# EasyEDA Pro project ProPrj_supercap v0.1_2026-02-15.epro, schematic Schematic1, sheets 1 to 3 of 5

## Sheets
1 P1: Board Name: Board1; Create Date: 2026-01-01; Page Name: P1; Project Name: supercap v0.1; Schematic Name: Schematic1; Update Date: 2026-02-13; Company: EasyEDA.com; Page Size: A4; Version: V1.0
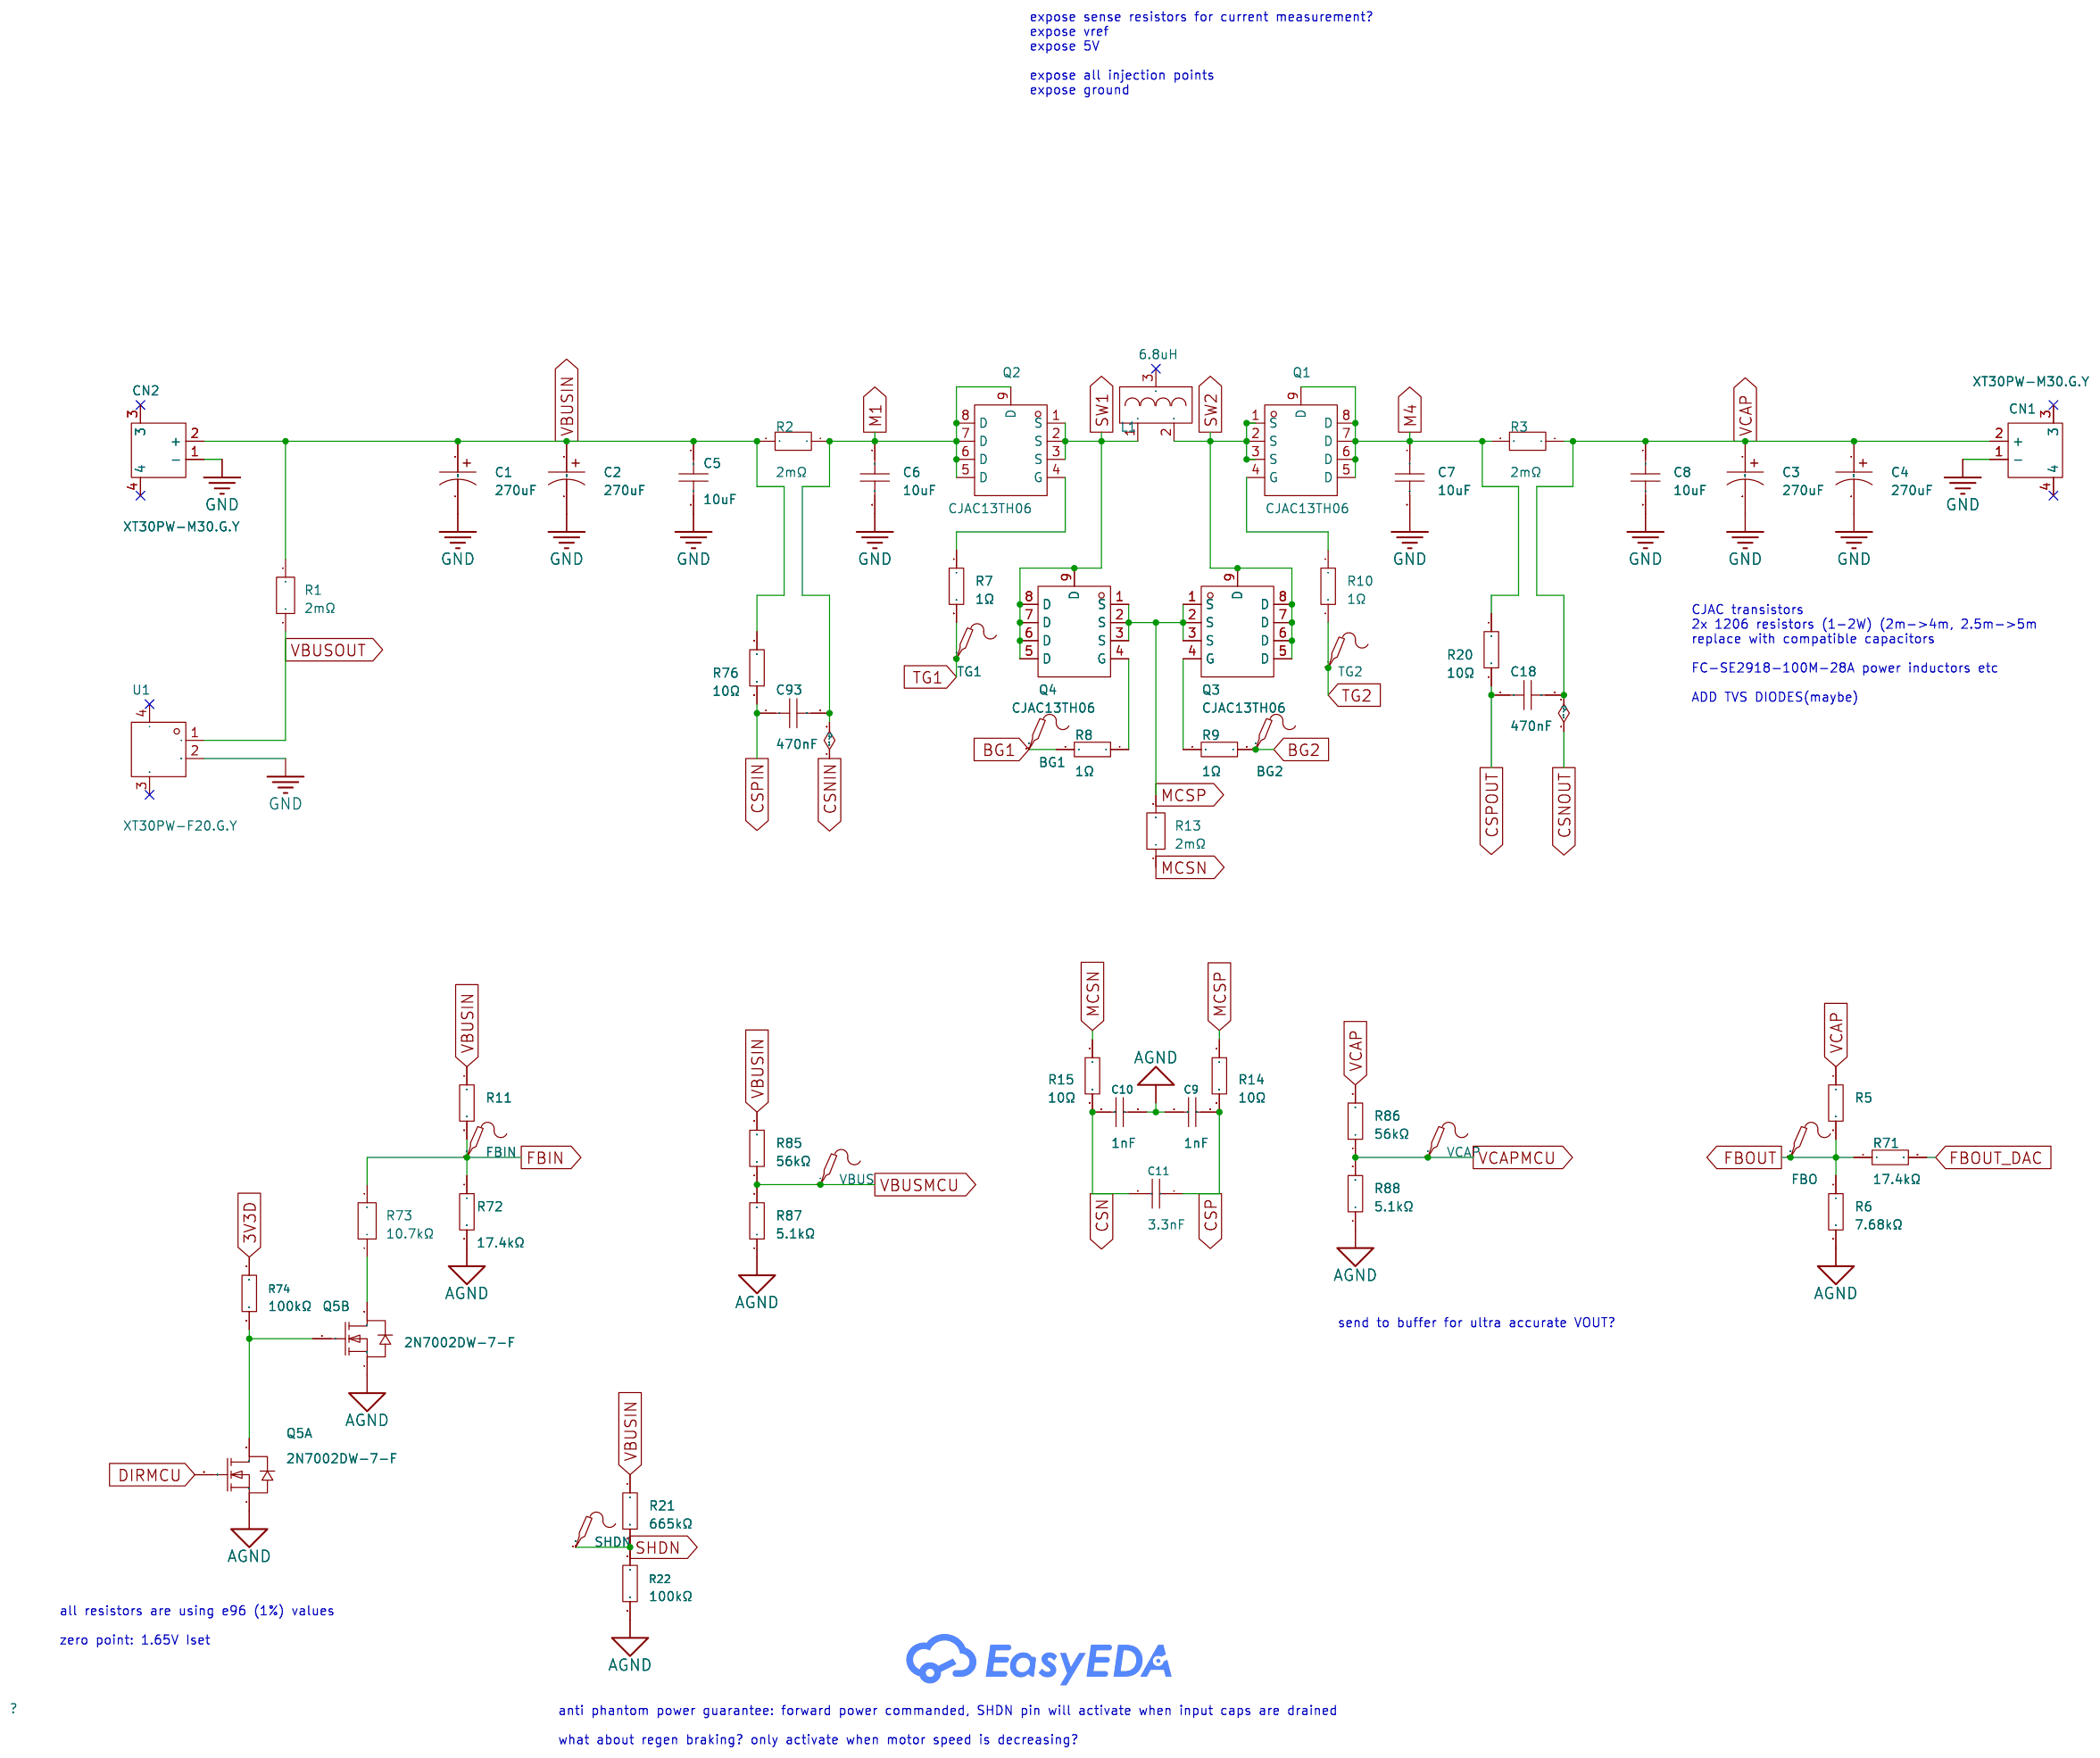
[diagram p0: P1]
2 P2: Page Name: P2
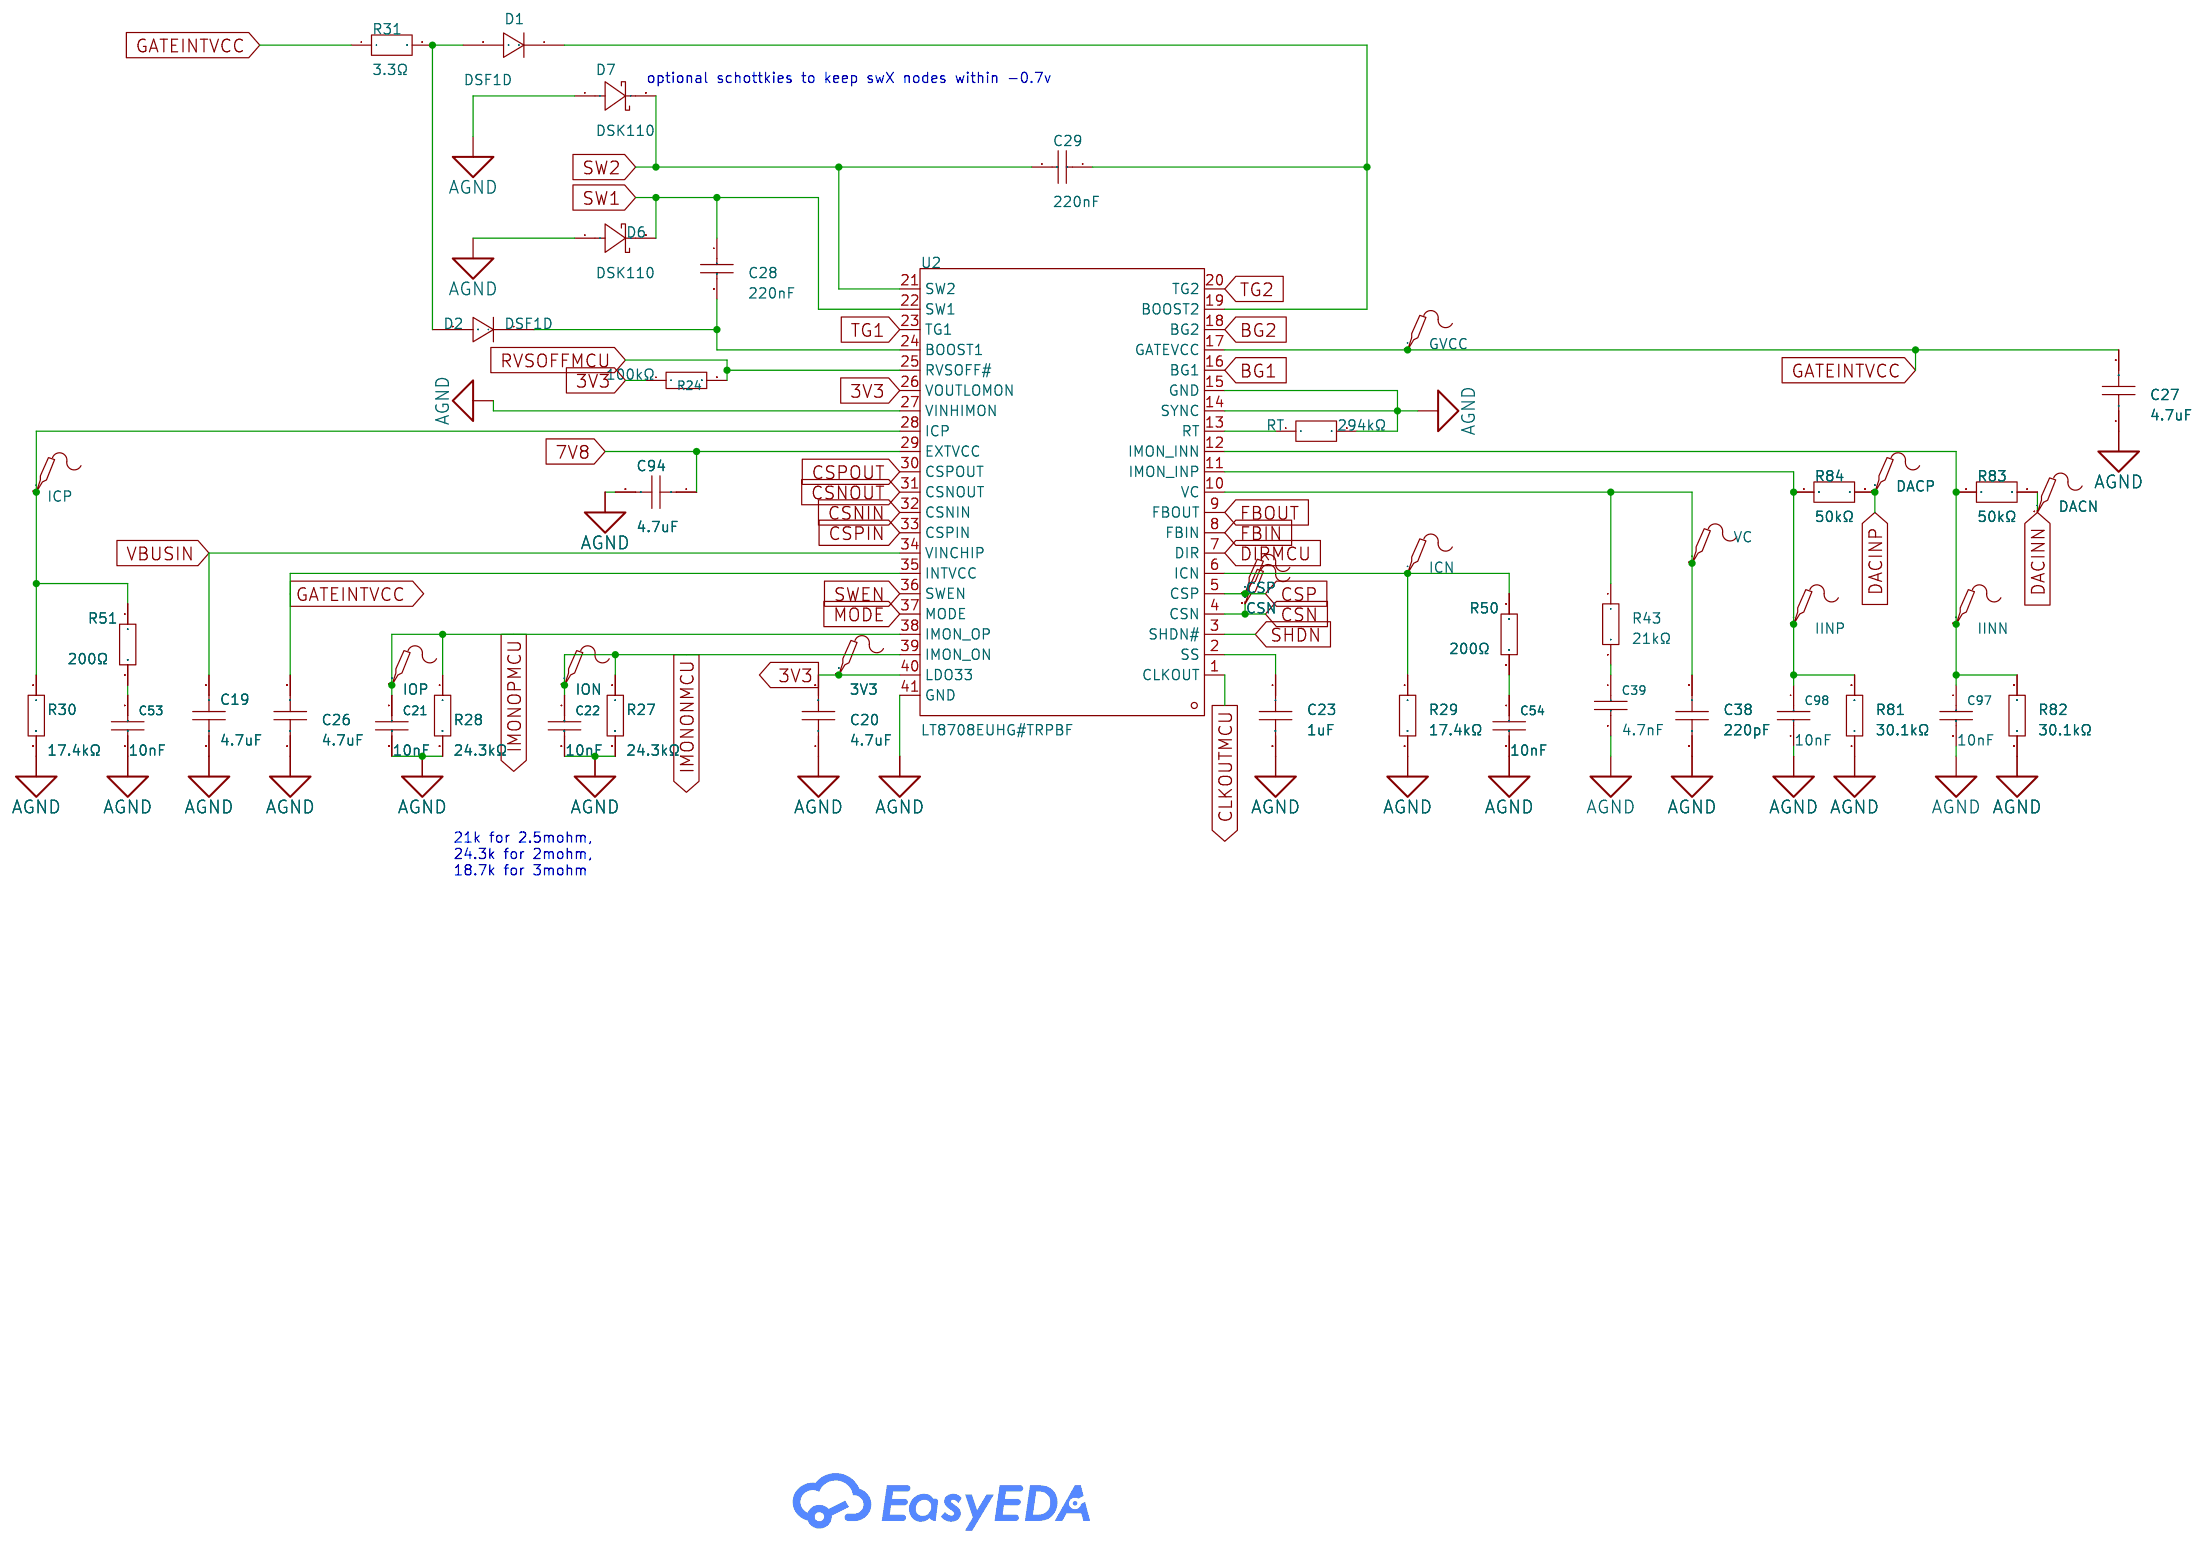
[diagram p1: P2]
3 P3: Page Name: P3; Update Date: 2026-01-31
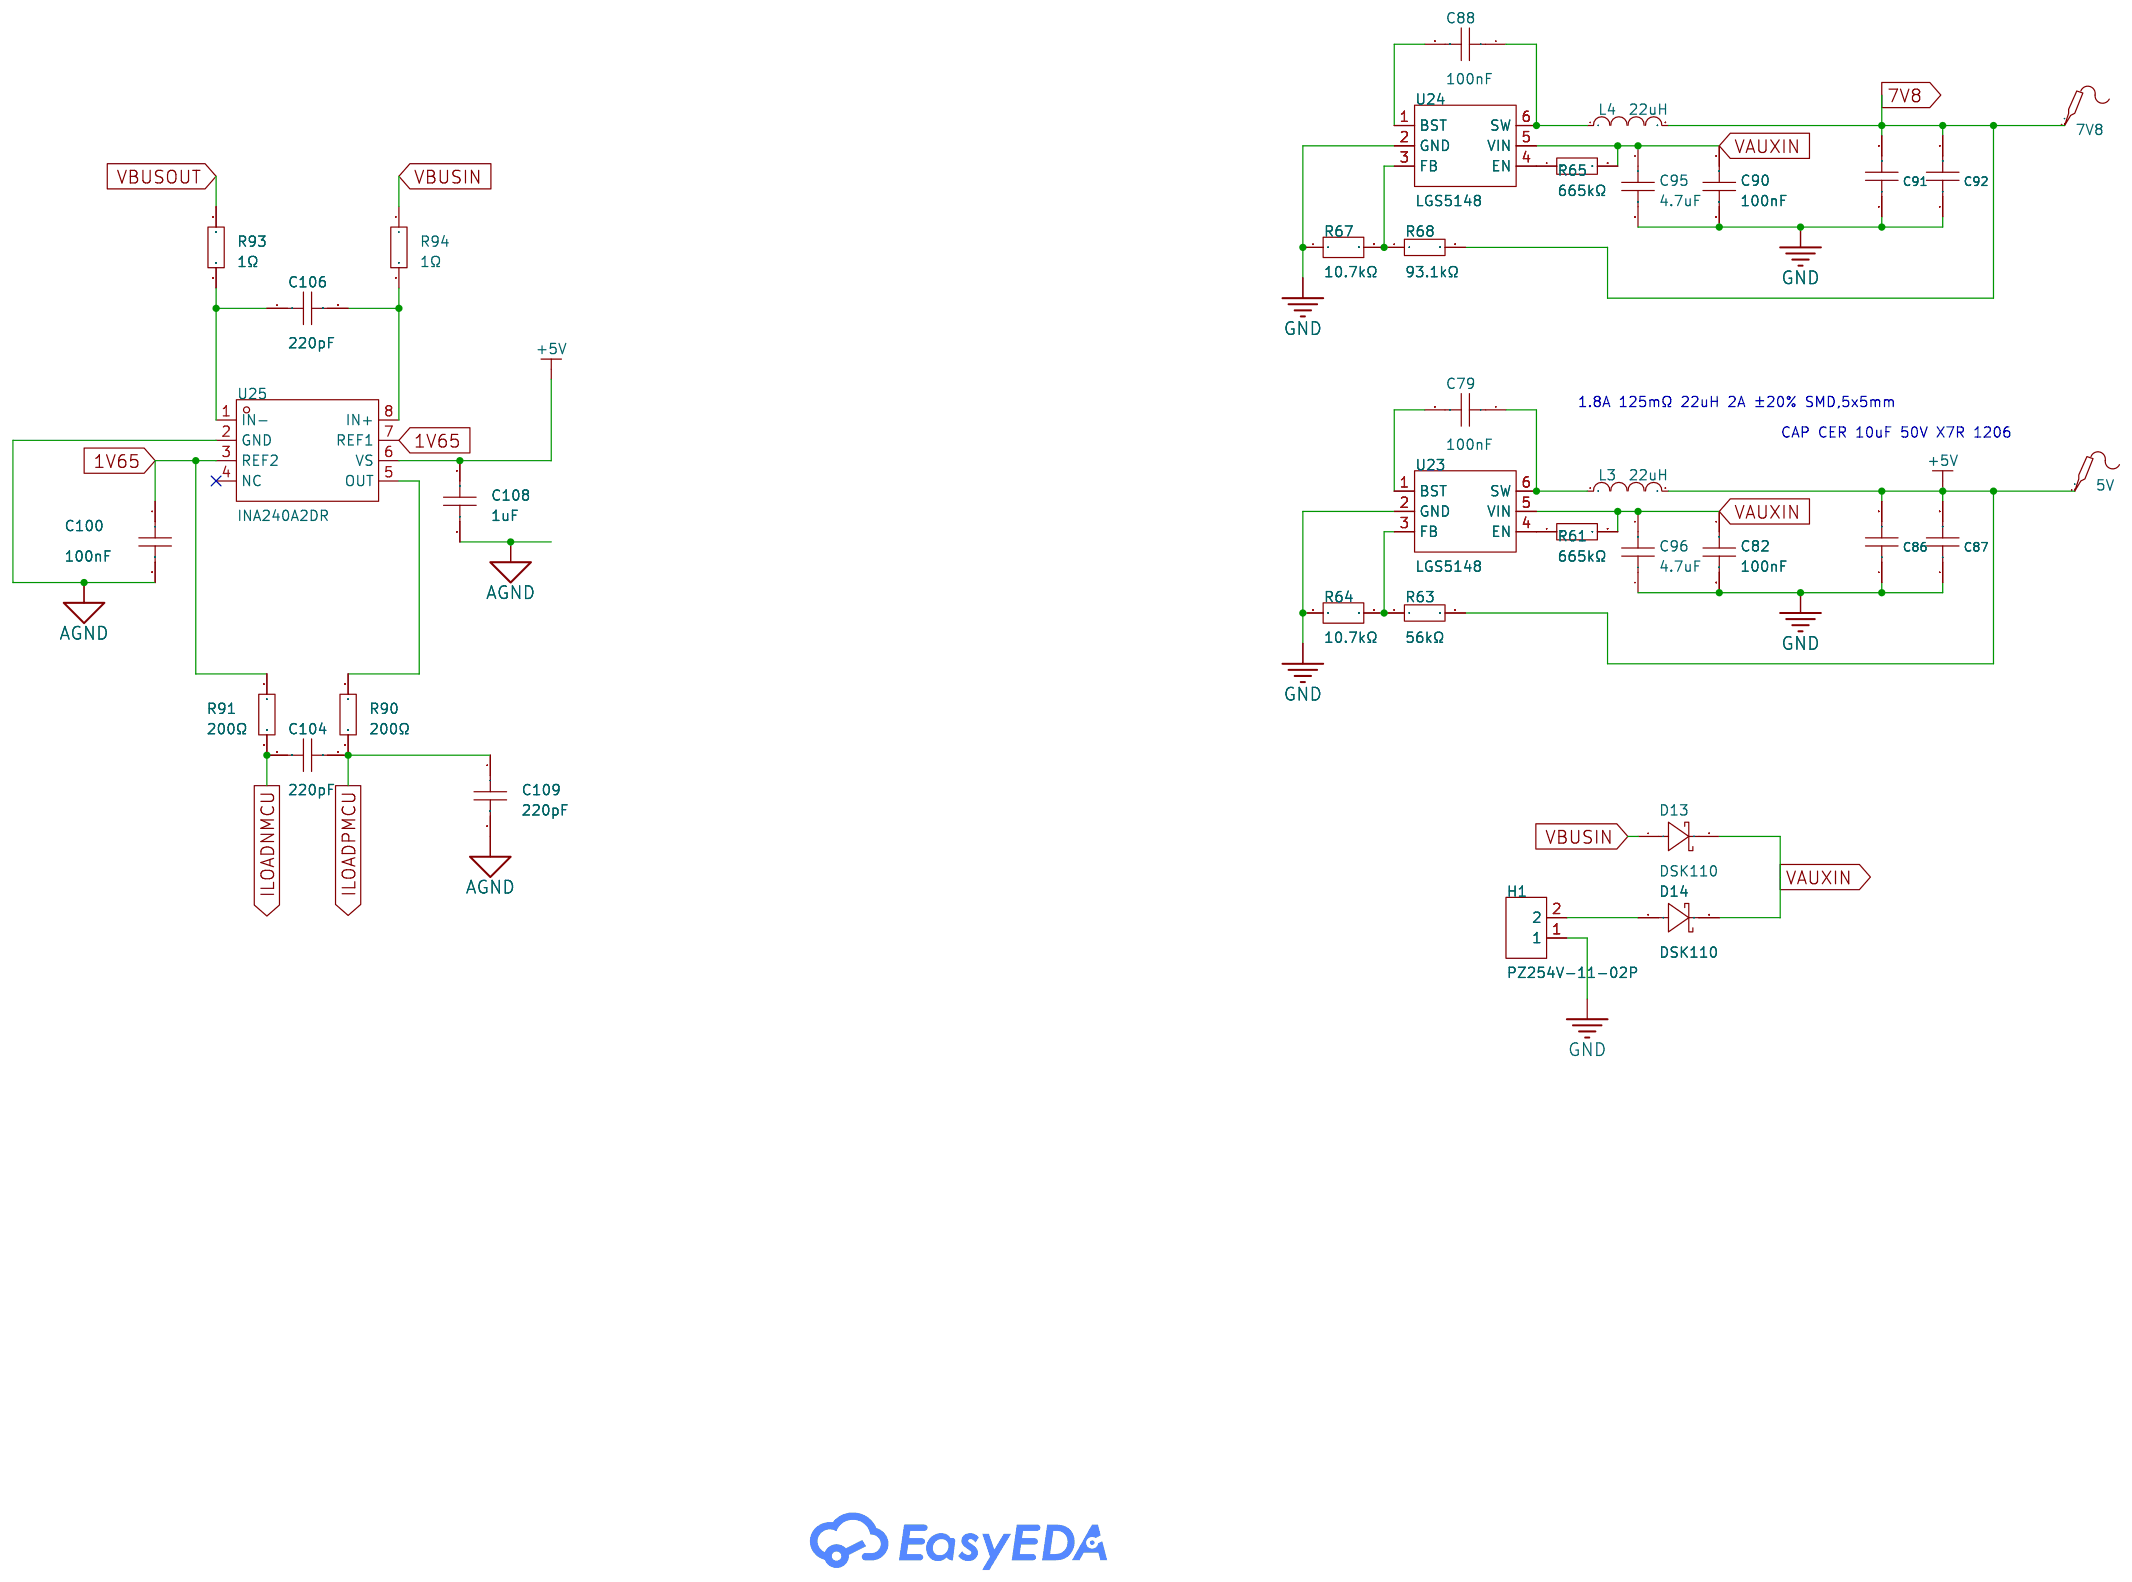
[diagram p2: P3]

## Parts
sheet P1
BG1  -  [Test-Point-0.5mm]
BG2  -  [Test-Point-0.5mm]
C1  270uF  [CAP-SMD_BD10.0-L10.3-W10.3-LS11.6-FD]
C2  270uF  [CAP-SMD_BD10.0-L10.3-W10.3-LS11.6-FD]
C3  270uF  [CAP-SMD_BD10.0-L10.3-W10.3-LS11.6-FD]
C4  270uF  [CAP-SMD_BD10.0-L10.3-W10.3-LS11.6-FD]
C5  10uF  [CAP-SMD_L6.0-W5.0]
C6  10uF  [CAP-SMD_L6.0-W5.0]
C7  10uF  [CAP-SMD_L6.0-W5.0]
C8  10uF  [CAP-SMD_L6.0-W5.0]
C9  1nF  [C0603]
C10  1nF  [C0603]
C11  3.3nF  [C0603]
C18  470nF  [C0603]
C93  470nF  [C0603]
CN1  XT30PW-M30.G.Y  [CONN-TH_XT30PW-M]
CN2  XT30PW-M30.G.Y  [CONN-TH_XT30PW-M]
FBIN  -  [Test-Point-0.5mm]
FBO  -  [Test-Point-0.5mm]
L1  6.8uH  [IND-SMD_3P-L27.9-W19.7-P10.43-LS27.9-BL-A]
Q1  CJAC13TH06  [PDFN-8_L5.8-W4.9-P1.27-LS6.1-BL]
Q2  CJAC13TH06  [PDFN-8_L5.8-W4.9-P1.27-LS6.1-BL]
Q3  CJAC13TH06  [PDFN-8_L5.8-W4.9-P1.27-LS6.1-BL]
Q4  CJAC13TH06  [PDFN-8_L5.8-W4.9-P1.27-LS6.1-BL]
Q5  2N7002DW-7-F  [SOT-363_L2.0-W1.3-P0.65-LS2.1-TL]  (sections 1,2)
R1  2mΩ  [R1225]
R2  2mΩ  [R1225]
R3  2mΩ  [R1225]
R5  137kΩ  [R0603]
R6  7.68kΩ  [R0603]
R7  1Ω  [R0603]
R8  1Ω  [R0603]
R9  1Ω  [R0603]
R10  1Ω  [R0603]
R11  137kΩ  [R0603]
R13  2mΩ  [R1225]
R14  10Ω  [R0603]
R15  10Ω  [R0603]
R20  10Ω  [R0603]
R21  665kΩ  [R0603]
R22  100kΩ  [R0603]
R71  17.4kΩ  [R0603]
R72  17.4kΩ  [R0603]
R73  10.7kΩ  [R0603]
R74  100kΩ  [R0603]
R76  10Ω  [R0603]
R85  56kΩ  [R0603]
R86  56kΩ  [R0603]
R87  5.1kΩ  [R0603]
R88  5.1kΩ  [R0603]
SHDN  -  [Test-Point-0.5mm]
TG1  -  [Test-Point-0.5mm]
TG2  -  [Test-Point-0.5mm]
U1  XT30PW-F20.G.Y  [CONN-TH_XT30PW-F-1]
VBUS  -  [Test-Point-0.5mm]
VCAP  -  [Test-Point-0.5mm]
sheet P2
3V3  -  [Test-Point-0.5mm]
C19  4.7uF  [C1206]
C20  4.7uF  [C0805]
C21  10nF  [C0603]
C22  10nF  [C0603]
C23  1uF  [C0603]
C26  4.7uF  [C0805]
C27  4.7uF  [C0805]
C28  220nF  [C0603]
C29  220nF  [C0603]
C38  220pF  [C0603]
C39  4.7nF  [C0603]
C53  10nF  [C0603]
C54  10nF  [C0603]
C94  4.7uF  [C1206]
C97  10nF  [C0603]
C98  10nF  [C0603]
CSN  -  [Test-Point-0.5mm]
CSP  -  [Test-Point-0.5mm]
D1  DSF1D  [SOD-123_L2.8-W1.8-LS3.7-RD]
D2  DSF1D  [SOD-123_L2.8-W1.8-LS3.7-RD]
D6  DSK110  [SOD-123_L2.8-W1.8-LS3.7-FD]
D7  DSK110  [SOD-123_L2.8-W1.8-LS3.7-FD]
DACN  -  [Test-Point-0.5mm]
DACP  -  [Test-Point-0.5mm]
GVCC  -  [Test-Point-0.5mm]
ICN  -  [Test-Point-0.5mm]
ICP  -  [Test-Point-0.5mm]
IINN  -  [Test-Point-0.5mm]
IINP  -  [Test-Point-0.5mm]
ION  -  [Test-Point-0.5mm]
IOP  -  [Test-Point-0.5mm]
R24  100kΩ  [R0603]
R27  24.3kΩ  [R0603]
R28  24.3kΩ  [R0603]
R29  17.4kΩ  [R0603]
R30  17.4kΩ  [R0603]
R31  3.3Ω  [R0603]
R43  21kΩ  [R0603]
R50  200Ω  [R0603]
R51  200Ω  [R0603]
R81  30.1kΩ  [R0603]
R82  30.1kΩ  [R0603]
R83  50kΩ  [R0603]
R84  50kΩ  [R0603]
RT  294kΩ  [R0603]
U2  LT8708EUHG#TRPBF  [QFN-40_L8.0-W5.0-P0.50-TL-EP_ADI_UHG]
VC  -  [Test-Point-0.5mm]
sheet P3
5V  -  [Test-Point-0.5mm]
7V8  -  [Test-Point-0.5mm]
C79  100nF  [C0603]
C82  100nF  [C0603]
C86  4.7uF  [C0805]
C87  4.7uF  [C0805]
C88  100nF  [C0603]
C90  100nF  [C0603]
C91  4.7uF  [C0805]
C92  4.7uF  [C0805]
C95  4.7uF  [C1206]
C96  4.7uF  [C1206]
C100  100nF  [C0603]
C104  220pF  [C0603]
C106  220pF  [C0603]
C108  1uF  [C0603]
C109  220pF  [C0603]  (no BOM)
D13  DSK110  [SOD-123_L2.8-W1.8-LS3.7-FD]
D14  DSK110  [SOD-123_L2.8-W1.8-LS3.7-FD]
H1  PZ254V-11-02P  [HDR-TH_2P-P2.54-V-M]  (no BOM)
L3  22uH  [IND-SMD_L5.0-W5.0_LVS505040]
L4  22uH  [IND-SMD_L5.0-W5.0_LVS505040]
R61  665kΩ  [R0603]
R63  56kΩ  [R0603]
R64  10.7kΩ  [R0603]
R65  665kΩ  [R0603]
R67  10.7kΩ  [R0603]
R68  93.1kΩ  [R0603]
R90  200Ω  [R0603]
R91  200Ω  [R0603]
R93  1Ω  [R0603]
R94  1Ω  [R0603]
U23  LGS5148  [SOT-23-6_L2.9-W1.6-P0.95-LS2.8-BL]
U24  LGS5148  [SOT-23-6_L2.9-W1.6-P0.95-LS2.8-BL]
U25  INA240A2DR  [SOIC-8_L4.9-W3.9-P1.27-LS6.0-BL]

## Library data of the parts
3V3 BG1 BG2 CSN CSP FBIN FBO GVCC ION IOP SHDN TG1 TG2 VC = Test-Point: Test Point 测试点; Check: true
C1-C4 = EEH-ZT1V271P: Capacitance:270uF Tolerance:±20% Tolerance:±20% Voltage Rating:35V Ripple Current:3.5A@100kHz Equivalent Series Resistance(ESR):16mΩ Lifetime:4000hrs@125℃ Operating Temperature:-55℃~+125℃ Operating Temperature:-55℃~+125℃ Pin Spacing:- Diameter:10mm Height; LCSC Part Name: 270uF ±20% 35V; Supplier Part: C1518246; Manufacturer: PANASONIC(松下); Supplier Footprint: SMD,D10xL10.5mm; JLCPCB Part Class: Extended Part; Datasheet: https://item.szlcsc.com/datasheet/EEH-ZT1V271P/1609043.html; Supplier: LCSC; Tolerance: ±20%; Voltage Rating: 35V; Ripple Current: 3.5A@100kHz; Equivalent Series Resistance(ESR): 16mΩ; Lifetime: 4000hrs@125℃; Operating Temperature: -55℃~+125℃; Diameter: 10mm; Height - Seated (Max): 10.5mm
C5-C8 = CKG57NX7R2A106MT009W: Capacitance:10uF Tolerance:±20% Tolerance:±20% Voltage Rating:100V Temperature Coefficient:X7R; LCSC Part Name: 10uF ±20% 100V; Supplier Part: C694536; Manufacturer: TDK; Supplier Footprint: 2220; JLCPCB Part Class: Extended Part; Datasheet: https://item.szlcsc.com/datasheet/CKG57NX7R2A106MT009W/727483.html; Supplier: LCSC; Tolerance: ±20%; Voltage Rating: 100V; Temperature Coefficient: X7R
C9 C10 = CC0603KRX7R9BB102: Capacitance: Tolerance:±10% Tolerance:±10% Voltage Rated: Temperature Coefficient:; LCSC Part Name: 1nF ±10% 50V; Supplier Part: C100040; Manufacturer: YAGEO(国巨); Supplier Footprint: 0603; JLCPCB Part Class: Extended Part; Datasheet: https://atta.szlcsc.com/upload/public/pdf/source/20180910/C282072_33301C7F631E79921B82A8DAC6BCC5B3.pdf; Supplier: LCSC; Tolerance: ±10%; Check: true
C11 = CC0603KRX7R9BB332: Capacitance: Tolerance:±10% Tolerance:±10% Voltage Rated: Temperature Coefficient:; LCSC Part Name: 3.3nF ±10% 50V; Supplier Part: C107088; Manufacturer: YAGEO(国巨); Supplier Footprint: 0603; JLCPCB Part Class: Extended Part; Datasheet: https://atta.szlcsc.com/upload/public/pdf/source/20180910/C282072_33301C7F631E79921B82A8DAC6BCC5B3.pdf; Supplier: LCSC; Tolerance: ±10%; Check: true
C18 C93 = CC0603KRX7R9BB474: Capacitance: Tolerance:±10% Tolerance:±10% Voltage Rated: Temperature Coefficient:; LCSC Part Name: 470nF ±10% 50V; Supplier Part: C513577; Manufacturer: YAGEO(国巨); Supplier Footprint: 0603; JLCPCB Part Class: Extended Part; Datasheet: https://atta.szlcsc.com/upload/public/pdf/source/20200423/C519417_FF9998E3F66D767819CD86A66B468321.pdf; Supplier: LCSC; Tolerance: ±10%; Check: true
CN1 CN2 = XT30PW-M30.G.Y: Power:- Output:- Input:- Size:- Interface:- Type:- Colour:- MaximumCurrent:- Type:Aviation model plug RatedVoltage:DC 500V Type1:- NumberOfUSBHoles:- InterfaceType:Male MetalMaterial:- InsulationMaterial:- RatedCurrent:15A RecommendedWireGauge:16/18/20AWG; LCSC Part Name: AMASS(艾迈斯)航模插头 卧式弯脚 XT30PW-M公头; Supplier Part: C431092; Manufacturer: AMASS(艾迈斯); JLCPCB Part Class: Extended Part; Datasheet: https://atta.szlcsc.com/upload/public/pdf/source/20220222/6A9F22F7850E25B33E1BE430ADF8560B.pdf; Supplier: LCSC; Type: Aviation model plug; RatedVoltage: DC 500V; InterfaceType: Male; RatedCurrent: 15A; RecommendedWireGauge: 16/18/20AWG; contact resistance: 1.2mΩ; specifications: 2pin; Check: true
L1 = SER2918H-682KL: Inductance:6.8uH Tolerance:±10% Tolerance:±10% Current Rating:25A Current - Saturation(Isat):45.9A DC Resistance(DCR):2.86mΩ Type:Magnetic Shielded Inductor Ratings:AEC-Q200; LCSC Part Name: 6.8uH ±10% 45.9A; Supplier Part: C3911802; Manufacturer: Coilcraft(线艺); JLCPCB Part Class: Extended Part; Datasheet: https://www.coilcraft.com/getmedia/a2805f49-c9b8-42c0-9939-b2d75eed7288/ser2900.pdf; Supplier: LCSC; Tolerance: ±10%; Current Rating: 25A; Current - Saturation(Isat): 45.9A; DC Resistance(DCR): 2.86mΩ; Type: Magnetic Shielded Inductor; Ratings: AEC-Q200
Q1-Q4 = CJAC13TH06: Type:1 N-Channel Drain Source Voltage (Vdss): Continuous Drain Current (Id): Drain Source On Resistance (RDS(on)@Vgs,Id):2.2mΩ@10V Power Dissipation (Pd): Gate Threshold Voltage (Vgs(th)@Id):1V@250uA Total Gate Charge (Qg@Vgs):63.7nC@10V Input Capacitance; LCSC Part Name: 1个N沟道 耐压:60V 电流:130A; Supplier Part: C504082; Manufacturer: CJ(江苏长电/长晶); Supplier Footprint: PQFNWB-8L(5x6); JLCPCB Part Class: Extended Part; Datasheet: https://atta.szlcsc.com/upload/public/pdf/source/20211104/6D1C972394E17010EFF79E24DEBC0797.pdf; Supplier: LCSC; Type: 1 N-Channel; Drain Source On Resistance (RDS(on)@Vgs,Id): 2.2mΩ@10V; Gate Threshold Voltage (Vgs(th)@Id): 1V@250uA; Total Gate Charge (Qg@Vgs): 63.7nC@10V; Input Capacitance (Ciss@Vds): 5.298nF; Reverse Transfer Capacitance (Crss@Vds): 74.8pF; Operating Temperature: -55℃~+150℃; Check: true
Q5 = 2N7002DW-7-F: Number:2 N-Channel Drain to Source Voltage:60V Current - Continuous Drain(Id):230mA RDS(on):7.5Ω@5V Pd - Power Dissipation:400mW Gate Threshold Voltage (Vgs(th)):2V@250uA Input Capacitance(Ciss):22pF Reverse Transfer Capacitance (Crss@Vds):2pF Operating T; LCSC Part Name: 2个N沟道 耐压:60V 电流:0.23A; Supplier Part: C83571; Manufacturer: DIODES(美台); Supplier Footprint: SOT-363; JLCPCB Part Class: Extended Part; Datasheet: https://item.szlcsc.com/datasheet/2N7002DW-7-F/84736.html; Supplier: LCSC; Number: 2 N-Channel; Drain to Source Voltage: 60V; Current - Continuous Drain(Id): 230mA; RDS(on): 7.5Ω@5V; Pd - Power Dissipation: 400mW; Gate Threshold Voltage (Vgs(th)): 2V@250uA; Input Capacitance(Ciss): 22pF; Reverse Transfer Capacitance (Crss@Vds): 2pF; Operating Temperature: -55℃~+150℃; Type: N-Channel; Output Capacitance(Coss): 11pF
R1-R3 R13 = WLTM1225RLR002FYR: Type:Current Sense Resistor Resistance:2mΩ Tolerance:±1% Tolerance:±1% Power(Watts):3W Temperature Coefficient:±100ppm/℃ Temperature Coefficient:±100ppm/℃; LCSC Part Name: 2mΩ ±1% 3W; Supplier Part: C20350198; Manufacturer: Littelfuse(美国力特); Supplier Footprint: 1225; JLCPCB Part Class: Extended Part; Datasheet: https://item.szlcsc.com/datasheet/WLTM1225RLR002FYR/21675728.html; Supplier: LCSC; Type: Current Sense Resistor; Tolerance: ±1%; Power(Watts): 3W; Temperature Coefficient: ±100ppm/℃
R5 R11 = 0603WAF1373T5E: Type:Thick Film Resistors Resistance:137kΩ Tolerance:±1% Tolerance:±1% Power(Watts):0.1W Voltage-Supply(Max):75V Temperature Coefficient:±100ppm/℃ Temperature Coefficient:±100ppm/℃ Operating Temperature:-55℃~+155℃ Operating Temperature:-55℃~+155℃; LCSC Part Name: 137kΩ ±1% 100mW 厚膜电阻; Supplier Part: C22872; Manufacturer: UNI-ROYAL(厚声); Supplier Footprint: 0603; JLCPCB Part Class: Extended Part; Datasheet: https://item.szlcsc.com/datasheet/0603WAF1373T5E/23599.html; Supplier: LCSC; Type: Thick Film Resistors; Tolerance: ±1%; Power(Watts): 0.1W; Voltage-Supply(Max): 75V; Temperature Coefficient: ±100ppm/℃; Operating Temperature: -55℃~+155℃
R6 = RT0603BRD077K68L: Type:Thin Film Resistor Resistance: Tolerance:±0.1% Tolerance:±0.1% Power(Watts): Overload Voltage (Max): Temperature Coefficient:±25ppm/℃ Temperature Coefficient:±25ppm/℃ Operating Temperature Range:-55℃~+155℃ Operating Temperature Range:-55℃~+155℃; LCSC Part Name: 薄膜电阻 7.68kΩ ±0.1% 100mW; Supplier Part: C375517; Manufacturer: YAGEO(国巨); Supplier Footprint: 0603; JLCPCB Part Class: Extended Part; Datasheet: https://atta.szlcsc.com/upload/public/pdf/source/20190227/C375517_CC2D9037C5877ACA9CB8399CF9A8D04C.pdf; Supplier: LCSC; Type: Thin Film Resistor; Tolerance: ±0.1%; Temperature Coefficient: ±25ppm/℃; Operating Temperature Range: -55℃~+155℃; Check: true
R7-R10 R93 R94 = RC0603FR-071RL: Type:Thick Film Resistors Resistance: Tolerance:±1% Tolerance:±1% Power(Watts): Overload Voltage (Max): Temperature Coefficient:±200ppm/℃ Temperature Coefficient:±200ppm/℃ Operating Temperature Range:-55℃~+155℃ Operating Temperature Range:-55℃~+155℃; LCSC Part Name: 厚膜电阻 1Ω ±1% 100mW; Supplier Part: C112305; Manufacturer: YAGEO(国巨); Supplier Footprint: 0603; JLCPCB Part Class: Extended Part; Datasheet: https://atta.szlcsc.com/upload/public/pdf/source/20230412/AFDB764CF169FCD02397F47E2BB81F5A.pdf; Supplier: LCSC; Type: Thick Film Resistors; Tolerance: ±1%; Temperature Coefficient: ±200ppm/℃; Operating Temperature Range: -55℃~+155℃; Check: true
R14 R15 R20 R76 = RC0603FR-0710RL: Type:Thick Film Resistors Resistance: Tolerance:±1% Tolerance:±1% Power(Watts): Overload Voltage (Max): Temperature Coefficient:±200ppm/℃ Temperature Coefficient:±200ppm/℃ Operating Temperature Range:-55℃~+155℃ Operating Temperature Range:-55℃~+155℃; LCSC Part Name: 厚膜电阻 10Ω ±1% 100mW; Supplier Part: C109318; Manufacturer: YAGEO(国巨); Supplier Footprint: 0603; JLCPCB Part Class: Extended Part; Datasheet: https://atta.szlcsc.com/upload/public/pdf/source/20180316/70C0E2BDAE7FCC62C531A5A58D202EE1.pdf; Supplier: LCSC; Type: Thick Film Resistors; Tolerance: ±1%; Temperature Coefficient: ±200ppm/℃; Operating Temperature Range: -55℃~+155℃; Check: true
R21 R61 R65 = AC0603FR-07665KL: Type:Thick Film Resistors Resistance: Tolerance:±1% Tolerance:±1% Power(Watts): Overload Voltage (Max): Temperature Coefficient:±100ppm/℃ Temperature Coefficient:±100ppm/℃ Operating Temperature Range:-55℃~+155℃ Operating Temperature Range:-55℃~+155℃; LCSC Part Name: 厚膜电阻 665kΩ ±1% 100mW; Supplier Part: C228009; Manufacturer: YAGEO(国巨); Supplier Footprint: 0603; JLCPCB Part Class: Extended Part; Datasheet: https://atta.szlcsc.com/upload/public/pdf/source/20181114/C228009_87E2C19250925041AC9BA1374DD90882.pdf; Supplier: LCSC; Type: Thick Film Resistors; Tolerance: ±1%; Temperature Coefficient: ±100ppm/℃; Operating Temperature Range: -55℃~+155℃; Check: true
R22 R24 R74 = RC0603FR-07100KL: Type:Thick Film Resistors Resistance: Tolerance:±1% Tolerance:±1% Power(Watts): Overload Voltage (Max): Temperature Coefficient:±100ppm/℃ Temperature Coefficient:±100ppm/℃ Operating Temperature Range:-55℃~+155℃ Operating Temperature Range:-55℃~+155℃; LCSC Part Name: 厚膜电阻 100kΩ ±1% 100mW; Supplier Part: C14675; Manufacturer: YAGEO(国巨); Supplier Footprint: 0603; JLCPCB Part Class: Extended Part; Datasheet: https://atta.szlcsc.com/upload/public/pdf/source/20140324/1457707028752.pdf; Supplier: LCSC; Type: Thick Film Resistors; Tolerance: ±1%; Temperature Coefficient: ±100ppm/℃; Operating Temperature Range: -55℃~+155℃; Check: true
R29 R30 R71 R72 = RC0603FR-0717K4L: Type:Thick Film Resistors Resistance: Tolerance:±1% Tolerance:±1% Power(Watts): Overload Voltage (Max): Temperature Coefficient:±100ppm/℃ Temperature Coefficient:±100ppm/℃ Operating Temperature Range:-55℃~+155℃ Operating Temperature Range:-55℃~+155℃; LCSC Part Name: 厚膜电阻 17.4kΩ ±1% 100mW; Supplier Part: C185365; Manufacturer: YAGEO(国巨); Supplier Footprint: 0603; JLCPCB Part Class: Extended Part; Datasheet: https://atta.szlcsc.com/upload/public/pdf/source/20180904/C276339_014E484F1DBA106FB92D45EABD5A1AC1.pdf; Supplier: LCSC; Type: Thick Film Resistors; Tolerance: ±1%; Temperature Coefficient: ±100ppm/℃; Operating Temperature Range: -55℃~+155℃; Check: true
R64 R67 R73 = RC0603FR-0710K7L: Type:Thick Film Resistors Resistance: Tolerance:±1% Tolerance:±1% Power(Watts): Overload Voltage (Max): Temperature Coefficient:±100ppm/℃ Temperature Coefficient:±100ppm/℃ Operating Temperature Range:-55℃~+155℃ Operating Temperature Range:-55℃~+155℃; LCSC Part Name: 厚膜电阻 10.7kΩ ±1% 100mW; Supplier Part: C482766; Manufacturer: YAGEO(国巨); Supplier Footprint: 0603; JLCPCB Part Class: Extended Part; Datasheet: https://atta.szlcsc.com/upload/public/pdf/source/20200715/C482766_42FE1960139F246AEBCCBE4167A6CC88.pdf; Supplier: LCSC; Type: Thick Film Resistors; Tolerance: ±1%; Temperature Coefficient: ±100ppm/℃; Operating Temperature Range: -55℃~+155℃
R63 R85 R86 = RC0603FR-0756KL: Type:Thick Film Resistors Resistance: Tolerance:±1% Tolerance:±1% Power(Watts): Overload Voltage (Max): Temperature Coefficient:±100ppm/℃ Temperature Coefficient:±100ppm/℃ Operating Temperature Range:-55℃~+155℃ Operating Temperature Range:-55℃~+155℃; LCSC Part Name: 厚膜电阻 56kΩ ±1% 100mW; Supplier Part: C114630; Manufacturer: YAGEO(国巨); Supplier Footprint: 0603; JLCPCB Part Class: Extended Part; Datasheet: https://atta.szlcsc.com/upload/public/pdf/source/20180821/C275644_0D56F95EFF785E7D9A1FEF436B37DA78.pdf; Supplier: LCSC; Type: Thick Film Resistors; Tolerance: ±1%; Temperature Coefficient: ±100ppm/℃; Operating Temperature Range: -55℃~+155℃
R87 R88 = RC0603FR-075K1L: Type:Thick Film Resistors Resistance:5.1kΩ Tolerance:±1% Tolerance:±1% Power(Watts):100mW Voltage-Supply(Max):75V Temperature Coefficient:±100ppm/℃ Temperature Coefficient:±100ppm/℃ Operating Temperature:-55℃~+155℃ Operating Temperature:-55℃~+155℃; LCSC Part Name: 厚膜电阻 5.1kΩ ±1% 100mW; Supplier Part: C105580; Manufacturer: YAGEO(国巨); Supplier Footprint: 0603; JLCPCB Part Class: Extended Part; Datasheet: https://item.szlcsc.com/datasheet/RC0603FR-075K1L/106795.html; Supplier: LCSC; Type: Thick Film Resistors; Tolerance: ±1%; Power(Watts): 100mW; Voltage-Supply(Max): 75V; Temperature Coefficient: ±100ppm/℃; Operating Temperature: -55℃~+155℃
U1 = XT30PW-F20.G.Y: Power:- Output:- Input:- Size:- Interface:- Type:- Colour:- MaximumCurrent:- Type:航模插头 RatedVoltage:- Type1:- NumberOfUSBHoles:- InterfaceType:母头 MetalMaterial:- InsulationMaterial:- RatedCurrent:- RecommendedWireGauge:- FlameRetardantGrade:- contact resi; LCSC Part Name: AMASS(艾迈斯)电源连接器 母头 XT30PW-F; Supplier Part: C2913282; Manufacturer: AMASS(艾迈斯); JLCPCB Part Class: Extended Part; Datasheet: https://atta.szlcsc.com/upload/public/pdf/source/20231218/06CFCF98887A9A87638B0856A725C8FD.pdf; Supplier: LCSC; Type: 航模插头; InterfaceType: 母头; Check: true
5V 7V8 DACN DACP ICN ICP IINN IINP VBUS VCAP = Test-Point: Test Point 测试点
C19 C94-C96 = GRM31CC72A475KE11L: Capacitance: Tolerance:±10% Tolerance:±10% Voltage Rated: Temperature Coefficient:; LCSC Part Name: 4.7uF ±10% 100V; Supplier Part: C237304; Manufacturer: muRata(村田); Supplier Footprint: 1206; JLCPCB Part Class: Extended Part; Datasheet: https://atta.szlcsc.com/upload/public/pdf/source/20200508/C237304_4DE028CC8A94E401326C46A1633456FC.pdf; Supplier: LCSC; Tolerance: ±10%; Check: true
C20 C26 C27 C86 C87 C91 C92 = GRM21BZ71H475KE15L: Capacitance:4.7uF Tolerance:±10% Tolerance:±10% Voltage Rating:50V Temperature Coefficient:X7R; LCSC Part Name: 4.7uF ±10% 50V; Supplier Part: C437557; Manufacturer: muRata(村田); Supplier Footprint: 0805; JLCPCB Part Class: Extended Part; Datasheet: https://item.szlcsc.com/datasheet/GRM21BZ71H475KE15L/436012.html; Supplier: LCSC; Tolerance: ±10%; Voltage Rating: 50V; Temperature Coefficient: X7R
C21 C22 C53 C54 C97 C98 = CC0603KRX7R9BB103: Capacitance: Tolerance:±10% Tolerance:±10% Voltage Rated: Temperature Coefficient:; LCSC Part Name: 10nF ±10% 50V; Supplier Part: C100042; Manufacturer: YAGEO(国巨); Supplier Footprint: 0603; JLCPCB Part Class: Extended Part; Datasheet: https://atta.szlcsc.com/upload/public/pdf/source/20181008/C309510_22F155564471FAF6A489F7D68F34234E.pdf; Supplier: LCSC; Tolerance: ±10%; Check: true
C23 C108 = CC0603KRX7R9BB105: Capacitance: Tolerance:±10% Tolerance:±10% Voltage Rated: Temperature Coefficient:; LCSC Part Name: 1uF ±10% 50V; Supplier Part: C559769; Manufacturer: YAGEO(国巨); Supplier Footprint: 0603; JLCPCB Part Class: Extended Part; Datasheet: https://atta.szlcsc.com/upload/public/pdf/source/20181031/C325451_C7CF01155AE3010E0D610C52F5FE7D31.pdf; Supplier: LCSC; Tolerance: ±10%; Check: true
C28 C29 = CL10B224KA8NNNC: Capacitance: Tolerance:±10% Tolerance:±10% Voltage Rated: Temperature Coefficient:; LCSC Part Name: 220nF ±10% 25V; Supplier Part: C21120; Manufacturer: SAMSUNG(三星); Supplier Footprint: 0603; JLCPCB Part Class: Basic Part; Datasheet: https://atta.szlcsc.com/upload/public/pdf/source/20160218/1457707763339.pdf; Supplier: LCSC; Tolerance: ±10%; Check: true
C38 C104 C106 C109 = CC0603JRNPO7BN221: Capacitance: Tolerance:±5% Tolerance:±5% Voltage Rated: Temperature Coefficient:; LCSC Part Name: 220pF ±5% 16V; Supplier Part: C3865744; Manufacturer: YAGEO(国巨); Supplier Footprint: 0603; JLCPCB Part Class: Extended Part; Datasheet: https://atta.szlcsc.com/upload/public/pdf/source/20231121/E6B7358C10879AC104478A67BFFD3D0E.pdf; Supplier: LCSC; Tolerance: ±5%; Check: true
C39 = GRM1885C1H472JA01D: Capacitance: Tolerance:±5% Tolerance:±5% Voltage Rated: Temperature Coefficient:; LCSC Part Name: 4.7nF ±5% 50V; Supplier Part: C85980; Manufacturer: muRata(村田); Supplier Footprint: 0603; JLCPCB Part Class: Extended Part; Datasheet: https://atta.szlcsc.com/upload/public/pdf/source/20200305/C490387_23319AE8C154DEB24C505E6C82A8106A.pdf; Supplier: LCSC; Tolerance: ±5%
D1 D2 = DSF1D E1D: Diode Configuration:Independent Voltage - Forward(Vf@If):1.25V@1.0A Voltage - DC Reverse(Vr):200V Current - Rectified:1A Reverse Leakage Current (Ir):100uA Reverse Recovery Time (trr):35ns Operating Junction Temperature Range:-55℃~+150℃@(Tj) Operating Jun; LCSC Part Name: 耐压:200V 电流:1A 反向恢复时间：35ns; Supplier Part: C64909; Manufacturer: MDD(辰达半导体); Supplier Footprint: SOD-123FL; JLCPCB Part Class: Extended Part; Datasheet: https://item.szlcsc.com/datasheet/DSF1D/65979.html; Supplier: LCSC; Diode Configuration: Independent; Forward Voltage (Vf@If): 1V@1A; Reverse Leakage Current (Ir): 100uA; Reverse Recovery Time (trr): 35ns; Operating Temperature: -55℃~+150℃@(Tj); Voltage - Forward(Vf@If): 1.25V@1.0A; Voltage - DC Reverse(Vr): 200V; Current - Rectified: 1A; Operating Junction Temperature Range: -55℃~+150℃@(Tj); Non-Repetitive Peak Forward Surge Current: 30A
D6 D7 D13 D14 = DSK110_C908227: Diode Configuration:- Forward Voltage (Vf@If):850mV@1A Reverse Voltage (Vr):100V Rectified Current:1A Reverse Leakage Current (Ir):500nA; LCSC Part Name: 电压:100V 电流:1A; Supplier Part: C908227; Manufacturer: FUXINSEMI(富芯森美); Supplier Footprint: SOD-123; JLCPCB Part Class: Extended Part; Datasheet: https://atta.szlcsc.com/upload/public/pdf/source/20201027/C908227_56774C7FA3F54032F9E299E0F5E1A587.pdf; Supplier: LCSC; Forward Voltage (Vf@If): 850mV@1A; Reverse Voltage (Vr): 100V; Rectified Current: 1A; Reverse Leakage Current (Ir): 500nA; Check: true
R27 R28 = RT0603BRD0724K3L: Type:Thin Film Resistor Resistance:24.3kΩ Tolerance:±0.1% Tolerance:±0.1% Power(Watts):100mW Voltage-Supply(Max):75V Temperature Coefficient:±25ppm/℃ Temperature Coefficient:±25ppm/℃ Operating Temperature:-55℃~+155℃ Operating Temperature:-55℃~+155℃; LCSC Part Name: 薄膜电阻 24.3kΩ ±0.1% 100mW; Supplier Part: C136968; Manufacturer: YAGEO(国巨); Supplier Footprint: 0603; JLCPCB Part Class: Extended Part; Datasheet: https://item.szlcsc.com/datasheet/RT0603BRD0724K3L/148284.html; Supplier: LCSC; Type: Thin Film Resistor; Tolerance: ±0.1%; Power(Watts): 100mW; Voltage-Supply(Max): 75V; Temperature Coefficient: ±25ppm/℃; Operating Temperature: -55℃~+155℃
R31 = AC0603JR-073R3L: Type:Thick Film Resistors Resistance: Tolerance:±5% Tolerance:±5% Power(Watts): Overload Voltage (Max): Temperature Coefficient:±200ppm/℃ Temperature Coefficient:±200ppm/℃ Operating Temperature Range:-55℃~+155℃ Operating Temperature Range:-55℃~+155℃; LCSC Part Name: 厚膜电阻 3.3Ω ±5% 100mW; Supplier Part: C228194; Manufacturer: YAGEO(国巨); Supplier Footprint: 0603; JLCPCB Part Class: Extended Part; Datasheet: https://atta.szlcsc.com/upload/public/pdf/source/20190301/C230000_FEACA6AA45ADCA89EA12E4E744ACE6F2.pdf; Supplier: LCSC; Type: Thick Film Resistors; Tolerance: ±5%; Temperature Coefficient: ±200ppm/℃; Operating Temperature Range: -55℃~+155℃; Check: true
R43 = RC0603FR-0721KL: Type:Thick Film Resistor Resistance:21kΩ Tolerance:±1% Tolerance:±1% Power(Watts):100mW Voltage-Supply(Max):75V Temperature Coefficient:±100ppm/℃ Temperature Coefficient:±100ppm/℃ Operating Temperature:-55℃~+155℃ Operating Temperature:-55℃~+155℃; LCSC Part Name: 厚膜电阻 21kΩ ±1% 100mW; Supplier Part: C137769; Manufacturer: YAGEO(国巨); Supplier Footprint: 0603; JLCPCB Part Class: Extended Part; Datasheet: https://item.szlcsc.com/datasheet/RC0603FR-0721KL/149085.html; Supplier: LCSC; Type: Thick Film Resistor; Tolerance: ±1%; Power(Watts): 100mW; Temperature Coefficient: ±100ppm/℃; Operating Temperature Range: -55℃~+155℃; Voltage-Supply(Max): 75V; Operating Temperature: -55℃~+155℃
R50 R51 R90 R91 = RC0603FR-07200RL: Type:Thick Film Resistors Resistance: Tolerance:±1% Tolerance:±1% Power(Watts): Overload Voltage (Max): Temperature Coefficient:±100ppm/℃ Temperature Coefficient:±100ppm/℃ Operating Temperature Range:-55℃~+155℃ Operating Temperature Range:-55℃~+155℃; LCSC Part Name: 厚膜电阻 200Ω ±1% 100mW; Supplier Part: C114664; Manufacturer: YAGEO(国巨); Supplier Footprint: 0603; JLCPCB Part Class: Extended Part; Datasheet: https://atta.szlcsc.com/upload/public/pdf/source/20180821/C275644_0D56F95EFF785E7D9A1FEF436B37DA78.pdf; Supplier: LCSC; Type: Thick Film Resistors; Tolerance: ±1%; Temperature Coefficient: ±100ppm/℃; Operating Temperature Range: -55℃~+155℃; Check: true
R81 R82 = RC0603FR-0730K1L: Type:Thick Film Resistors Resistance: Tolerance:±1% Tolerance:±1% Power(Watts): Overload Voltage (Max): Temperature Coefficient:±100ppm/℃ Temperature Coefficient:±100ppm/℃ Operating Temperature Range:-55℃~+155℃ Operating Temperature Range:-55℃~+155℃; LCSC Part Name: 厚膜电阻 30.1kΩ ±1% 100mW; Supplier Part: C137745; Manufacturer: YAGEO(国巨); Supplier Footprint: 0603; JLCPCB Part Class: Extended Part; Datasheet: https://atta.szlcsc.com/upload/public/pdf/source/20180821/C275644_0D56F95EFF785E7D9A1FEF436B37DA78.pdf; Supplier: LCSC; Type: Thick Film Resistors; Tolerance: ±1%; Temperature Coefficient: ±100ppm/℃; Operating Temperature Range: -55℃~+155℃
R83 R84 = RT0603BRD0750KL: Type:Thin Film Resistor Resistance:50kΩ Tolerance:±0.1% Tolerance:±0.1% Power(Watts):100mW Voltage-Supply(Max):75V Temperature Coefficient:±25ppm/℃ Temperature Coefficient:±25ppm/℃ Operating Temperature:-55℃~+155℃ Operating Temperature:-55℃~+155℃; LCSC Part Name: 薄膜电阻 50kΩ ±0.1% 100mW; Supplier Part: C861451; Manufacturer: YAGEO(国巨); Supplier Footprint: 0603; JLCPCB Part Class: Extended Part; Datasheet: https://item.szlcsc.com/datasheet/RT0603BRD0750KL/921789.html; Supplier: LCSC; Type: Thin Film Resistor; Tolerance: ±0.1%; Power(Watts): 100mW; Voltage-Supply(Max): 75V; Temperature Coefficient: ±25ppm/℃; Operating Temperature: -55℃~+155℃
RT = RT0603BRD07294KL: Type:Thin Film Resistor Resistance: Tolerance:±0.1% Tolerance:±0.1% Power(Watts): Temperature Coefficient:±25ppm/℃ Temperature Coefficient:±25ppm/℃ Operating Temperature Range:-55℃~+155℃ Operating Temperature Range:-55℃~+155℃; LCSC Part Name: 薄膜电阻 294kΩ ±0.1% 100mW; Supplier Part: C861286; Manufacturer: YAGEO(国巨); Supplier Footprint: 0603; JLCPCB Part Class: Extended Part; Datasheet: https://atta.szlcsc.com/upload/public/pdf/source/20200610/C326738_5639A9F1B6EB6E4AE2197577D3456E7F.pdf; Supplier: LCSC; Type: Thin Film Resistor; Tolerance: ±0.1%; Temperature Coefficient: ±25ppm/℃; Operating Temperature Range: -55℃~+155℃; Check: true
U2 = LT8708EUHG#TRPBF: Function:Buck-boost type Input Voltage:2.8V~80V Input Voltage:2.8V~80V Switching Frequency:400kHz Operating Temperature:-40℃~+125℃ Operating Temperature:-40℃~+125℃ Synchronous Rectification:Yes Number of Outputs:1 Topology:Step-down-Boost; Supplier Part: C2658801; Manufacturer: ADI(亚德诺); Supplier Footprint: QFN-40-EP(5x8); JLCPCB Part Class: Extended Part; Datasheet: https://atta.szlcsc.com/upload/public/pdf/source/20210601/0A4036ACA6D5292E858C905D6C703EE3.pdf; Supplier: LCSC; Function: Buck-boost type; Input Voltage: 2.8V~80V; Switching Frequency: 400kHz; Operating Temperature: -40℃~+125℃; Synchronous Rectification: Yes; Number of Outputs: 1; Topology: Step-down-Boost; Check: true
C79 C82 C88 C90 C100 = CL10B104KC8NNNC: Capacitance:100nF Tolerance:±10% Tolerance:±10% Voltage Rating:100V Temperature Coefficient:X7R; LCSC Part Name: 100nF ±10% 100V; Supplier Part: C15725; Manufacturer: SAMSUNG(三星); Supplier Footprint: 0603; JLCPCB Part Class: Extended Part; Datasheet: https://item.szlcsc.com/datasheet/CL10B104KC8NNNC/16407.html; Supplier: LCSC; Tolerance: ±10%; Voltage Rating: 100V; Temperature Coefficient: X7R; Check: true
H1 = PZ254V-11-02P: Pin Structure:1x2P Pitch:2.54mm Row Spacing:- Circluar Pins/Square Pins:Pin Header Mounting Type:Through Hole Number of Rows:1 Number of Pins:2P Current Rating:- Voltage Rating (Max):- Length of Mating Pin:6mm Insulation Height:2.5mm Length of End Connect; LCSC Part Name: 1x2P 间距:2.54mm 方针 直插; Supplier Part: C492401; Manufacturer: XFCN(兴飞); Supplier Footprint: 插件,P=2.54mm; JLCPCB Part Class: Extended Part; Datasheet: https://item.szlcsc.com/datasheet/PZ254V-11-02P/502957.html; Supplier: LCSC; Pin Structure: 1x2P; Pitch: 2.54mm; Circluar Pins/Square Pins: Pin Header; Mounting Type: Through Hole; Number of Rows: 1; Number of Pins: 2P; Length of Mating Pin: 6mm; Insulation Height: 2.5mm; Length of End Connection Pin: 3mm; Contact Material: Brass; Operating Temperature: -40℃~+105℃; Color: Black
L3 L4 = VLS5045EX-220M: Inductance: Tolerance:±20% Tolerance:±20% Rated Current: Saturation Current (Isat):2A DC Resistance (DCR): Type:- Ratings:-; LCSC Part Name: 22uH ±20% 2A; Supplier Part: C307873; Manufacturer: TDK; Supplier Footprint: SMD; JLCPCB Part Class: Extended Part; Datasheet: https://atta.szlcsc.com/upload/public/pdf/source/20191009/C434837_822BE1235634A0A244FACF4AD1BF0D88.pdf; Supplier: LCSC; Tolerance: ±20%; Saturation Current (Isat): 2A
R68 = AC0603FR-0793K1L: Type:Thick Film Resistor Resistance:93.1kΩ Tolerance:±1% Tolerance:±1% Power(Watts):100mW Voltage-Supply(Max):75V Temperature Coefficient:±100ppm/℃ Temperature Coefficient:±100ppm/℃ Operating Temperature:-55℃~+155℃ Operating Temperature:-55℃~+155℃; LCSC Part Name: 厚膜电阻 93.1kΩ ±1% 100mW; Supplier Part: C228101; Manufacturer: YAGEO(国巨); Supplier Footprint: 0603; JLCPCB Part Class: Extended Part; Datasheet: https://item.szlcsc.com/datasheet/AC0603FR-0793K1L/228326.html; Supplier: LCSC; Type: Thick Film Resistor; Tolerance: ±1%; Power(Watts): 100mW; Voltage-Supply(Max): 75V; Temperature Coefficient: ±100ppm/℃; Operating Temperature: -55℃~+155℃
U23 U24 = LGS5148: Function:Buck Output Type:- Voltage - Supply:8V~48V Voltage - Supply:8V~48V Output Voltage:- Output Voltage:- Output Current:600mA Frequency - Switching:900kHz Frequency - Switching:900kHz Operating Temperature:-40℃~+125℃ Operating Temperature:-40℃~+125℃; LCSC Part Name: 48V 600mA高效同步降压转换器; Supplier Part: C5123972; Manufacturer: Legend-Si(棱晶半导体); Supplier Footprint: SOT-23-6; JLCPCB Part Class: Extended Part; Datasheet: https://item.szlcsc.com/datasheet/LGS5148/5718439.html; Supplier: LCSC; Function: Buck; Voltage - Supply: 8V~48V; Output Current: 600mA; Frequency - Switching: 900kHz; Operating Temperature: -40℃~+125℃; Synchronous Rectifier: Yes; Number of Outputs: 1; Topology: Buck; Switch tube (built-in/external): Built-in
U25 = INA240A2DR: Number of Channels:Single channel Supply Current:1.8mA Operating Temperature:-40℃~+125℃ Operating Temperature:-40℃~+125℃; LCSC Part Name: 电流检测放大器指南; Supplier Part: C2060768; Manufacturer: TI(德州仪器); Supplier Footprint: SOIC-8; JLCPCB Part Class: Extended Part; Datasheet: https://www.ti.com/cn/lit/gpn/ina240; Supplier: LCSC; Number of Channels: Single channel; Supply Current: 1.8mA; Operating Temperature: -40℃~+125℃

## Nets
1V65: C100.1 R91.1 U25.3(REF2) U25.7(REF1) ; also on sheet 5
3V3: 3V3.1 C20.2 R24.1 U2.26(VOUTLOMON) U2.40(LDO33)
3V3D: R74.1 ; also on sheet 4 5
7V8: 7V8.1 C91.2 C92.2 C94.1 L4.2 R68.2 U2.29(EXTVCC)
+5V: 5V.1 C86.2 C87.2 C108.1 L3.2 R63.2 U25.6(VS) ; also on sheet 4 5
AGND: C9.2 C10.1 C19.2 C20.1 C21.2 C22.2 C23.2 C26.1 C27.1 C38.2 C39.2 C53.2 C54.2 C94.2 C97.2 C98.2 C100.2 C108.2 C109.2 D6.1(A) D7.1(A) Q5.1(S2) Q5.4(S1) R6.2 R22.2 R27.2 R28.2 R29.2 R30.2 R72.2 R81.1 R82.1 R87.1 R88.1 RT.2 U2.14(SYNC) U2.15(GND) U2.27(VINHIMON) U2.41(GND) U25.2(GND) ; also on sheet 4 5
GND: C1.2 C2.2 C3.2 C4.2 C5.2 C6.2 C7.2 C8.2 C82.2 C86.1 C87.1 C90.2 C91.1 C92.1 C95.2 C96.1 CN1.1(-) CN2.1(-) H1.1 R64.1 R67.1 U1.2 U23.2(GND) U24.2(GND)
VBUSIN: C1.1 C2.1 C5.1 C19.1 CN2.2(+) D13.1(A) R1.1 R2.2 R11.1 R21.1 R76.1 R85.2 R94.1 U2.34(VINCHIP)
VBUSMCU: R85.1 R87.2 VBUS.1 ; also on sheet 5
VBUSOUT: R1.2 R93.1 U1.1
BG1: BG1.1 R8.2 U2.16(BG1)
BG2: BG2.1 R9.2 U2.18(BG2)
CLKOUTMCU: U2.1(CLKOUT) ; also on sheet 5
CSN: C10.2 C11.2 CSN.1 R15.2 U2.4(CSN)
CSNIN: C6.1 C93.2 Q2.5(D) Q2.6(D) Q2.7(D) Q2.8(D) Q2.9(D) R2.1 U2.32(CSNIN)
CSNOUT: C3.1 C4.1 C8.1 C18.2 CN1.2(+) R3.1 R5.1 R86.2 U2.31(CSNOUT)
CSP: C9.1 C11.1 CSP.1 R14.2 U2.5(CSP)
CSPIN: C93.1 R76.2 U2.33(CSPIN)
CSPOUT: C18.1 R20.2 U2.30(CSPOUT)
DACINN: DACN.1 R83.1 ; also on sheet 5
DACINP: DACP.1 R84.2 ; also on sheet 5
DIRMCU: Q5.5(G1) U2.7(DIR) ; also on sheet 5
FBIN: FBIN.1 R11.2 R72.1 R73.2 U2.8(FBIN)
FBOUT: FBO.1 R5.2 R6.1 R71.1 U2.9(FBOUT)
FBOUT_DAC: R71.2 ; also on sheet 5
GATEINTVCC: C26.2 C27.2 GVCC.1 R31.1 U2.17(GATEVCC) U2.35(INTVCC)
ILOADNMCU: C104.2 R91.2 ; also on sheet 5
ILOADPMCU: C104.1 C109.1 R90.2 ; also on sheet 5
IMONONMCU: C22.1 ION.1 R27.1 U2.39(IMON_ON) ; also on sheet 5
IMONOPMCU: C21.1 IOP.1 R28.1 U2.38(IMON_OP) ; also on sheet 5
M4: C7.1 Q1.5(D) Q1.6(D) Q1.7(D) Q1.8(D) Q1.9(D) R3.2 R20.1
MCSN: R13.1 R15.1
MCSP: Q3.1(S) Q3.2(S) Q3.3(S) Q4.1(S) Q4.2(S) Q4.3(S) R13.2 R14.1
MODE: U2.37(MODE) ; also on sheet 5
RVSOFFMCU: R24.2 U2.25(RVSOFF#) ; also on sheet 5
SHDN: R21.2 R22.1 SHDN.1 U2.3(SHDN#)
SW1: C28.1 D6.2(K) L1.1 Q2.1(S) Q2.2(S) Q2.3(S) Q4.5(D) Q4.6(D) Q4.7(D) Q4.8(D) Q4.9(D) U2.22(SW1)
SW2: C29.1 D7.2(K) L1.2 Q1.1(S) Q1.2(S) Q1.3(S) Q3.5(D) Q3.6(D) Q3.7(D) Q3.8(D) Q3.9(D) U2.21(SW2)
SWEN: U2.36(SWEN) ; also on sheet 5
TG1: R7.2 TG1.1 U2.23(TG1)
TG2: R10.2 TG2.1 U2.20(TG2)
VAUXIN: C82.1 C90.1 C95.1 C96.2 D13.2(K) D14.2(K) R61.2 R65.2 U23.5(VIN) U24.5(VIN)
VCAPMCU: R86.1 R88.2 VCAP.1 ; also on sheet 5
$1N2584: Q4.4(G) R8.1
$1N2588: Q3.4(G) R9.1
$1N2593: Q1.4(G) R10.1
$1N2600: Q2.4(G) R7.1
$1N21405: Q5.6(D2) R73.1
$1N21448: Q5.2(G2) Q5.3(D1) R74.2
$2N503: RT.1 U2.13(RT)
$2N2242: C23.1 U2.2(SS)
$2N2570: ICN.1 R29.1 R50.1 U2.6(ICN)
$2N3394: C28.2 D2.1 U2.24(BOOST1)
$2N3435: C29.2 D1.1 U2.19(BOOST2)
$2N3475: D1.2 D2.2 R31.2
$2N4494: C38.1 R43.1 U2.10(VC) VC.1
$2N4749: C39.1 R43.2
$2N11449: C54.1 R50.2
$2N11490: C53.1 R51.2
$2N11498: ICP.1 R30.1 R51.1 U2.28(ICP)
$2N14127: C98.1 IINP.1 R81.2 R84.1 U2.11(IMON_INP)
$2N14132: C97.1 IINN.1 R82.2 R83.2 U2.12(IMON_INN)
$3N12365: C79.2 U23.1(BST)
$3N12371: C79.1 L3.1 U23.6(SW)
$3N12409: R63.1 R64.2 U23.3(FB)
$3N12423: R61.1 U23.4(EN)
$3N14012: C88.2 U24.1(BST)
$3N14015: C88.1 L4.1 U24.6(SW)
$3N14023: R67.2 R68.1 U24.3(FB)
$3N14026: R65.1 U24.4(EN)
$3N18397: C106.1 R93.2 U25.1(IN-)
$3N18401: C106.2 R94.2 U25.8(IN+)
$3N18526: R90.1 U25.5(OUT)
$3N18889: D14.1(A) H1.2

Not connected (* = marked no-connect by the designer): CN1 3* 4*; CN2 3* 4*; L1 3*; U1 3* 4*; U25 4(NC)*

## Notes on the sheets
sheet 1
- expose sense resistors for current measurement?
  expose vref
  expose 5V
  expose all injection points
  expose ground
- CJAC transistors
  2x 1206 resistors (1-2W) (2m->4m, 2.5m->5m
  replace with compatible capacitors
  FC-SE2918-100M-28A power inductors etc
  ADD TVS DIODES(maybe)
- send to buffer for ultra accurate VOUT?
- all resistors are using e96 (1%) values
  zero point: 1.65V Iset
- anti phantom power guarantee: forward power commanded, SHDN pin will activate when input caps are drained
  what about regen braking? only activate when motor speed is decreasing?
sheet 2
- optional schottkies to keep swX nodes within -0.7v
- 21k for 2.5mohm,
  24.3k for 2mohm,
  18.7k for 3mohm
sheet 3
- 1.8A 125mΩ 22uH 2A ±20% SMD,5x5mm
- CAP CER 10uF 50V X7R 1206
